# EAGLE design BoxVersion_Taster_v1 (EAGLE 6.2)
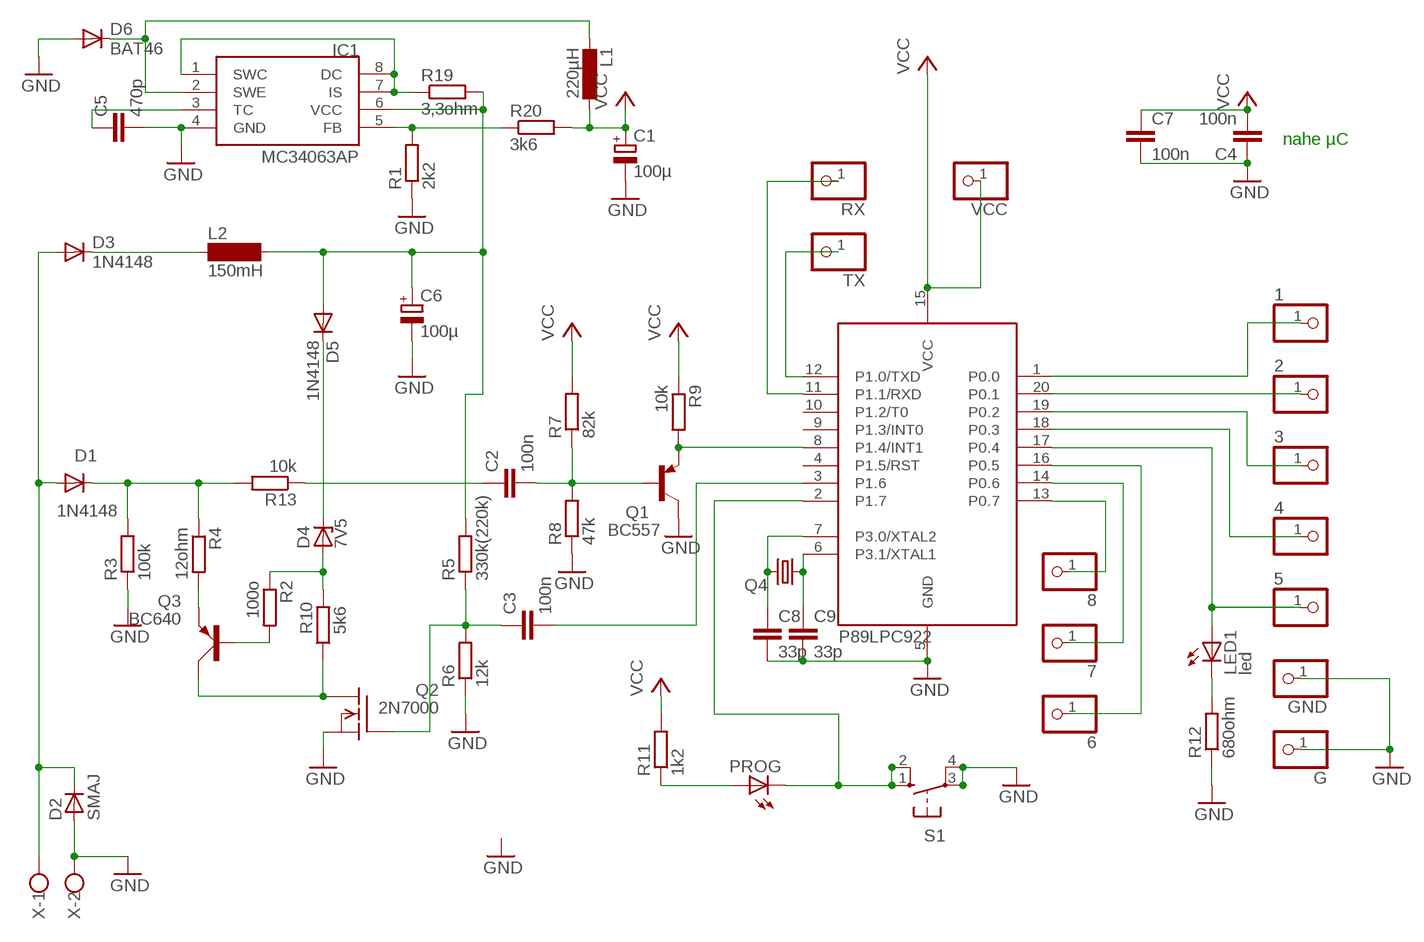
[diagram p0: schematic, sheet 1]

## Parts
1  PINHD-1X1  [1X01]
2  PINHD-1X1  [1X01]
3  PINHD-1X1  [1X01]
4  PINHD-1X1  [1X01]
5  PINHD-1X1  [1X01]
6  PINHD-1X1  [1X01]
7  PINHD-1X1  [1X01]
8  PINHD-1X1  [1X01]
C1  100µ  CPOL-EUE5-5  [E5-5]
C2  100n  C-EU050-024X044  [C050-024X044]
C3  100n  C-EU050-024X044  [C050-024X044]
C4  100n  C-EU050-024X044  [C050-024X044]
C5  470p  C-EU025-024X044  [C025-024X044]
C6  100µ  CPOL-EUE5-6  [E5-6]
C7  100n  C-EUC1206  [C1206]
C8  33p  C-EUC1206  [C1206]
C9  33p  C-EUC1206  [C1206]
D1  1N4148  1N41481N4148S  [D-2.5]
D2  SMAJ  D-MLL-41  [MELF-MLL41]
D3  1N4148  1N41481N4148S  [D-2.5]
D4  7V5  ZENER-DIODEZD-2.5  [ZDIO-2.5]
D5  1N4148  1N41481N4148S  [D-2.5]
D6  BAT46  DIODE-D-2.5  [D-2.5]
G  PINHD-1X1  [1X01]
GND  PINHD-1X1  [1X01]
IC1  MC34063AP  [DIL08]
L1  220µH  L-EU0204/7  [0204/7]
L2  150mH  SD12K100  [SD12K100]
LED1  led  LEDLZR181  [LZR181]
PROG  LEDLZR181  [LZR181]
Q1  BC557  [TO92]
Q2  2N7000  VN2222KM  [TO237]
Q3  BC640  [SOT54D]
Q4  CRYSTALHC49S  [HC49/S]
R1  2k2  R-EU_0207/2V  [0207/2V]
R2  100o  R-EU_0207/2V  [0207/2V]
R3  100k  R-EU_0207/2V  [0207/2V]
R4  12ohm  R-EU_0207/2V  [0207/2V]
R5  330k(220k)  R-EU_0207/2V  [0207/2V]
R6  12k  R-EU_0207/2V  [0207/2V]
R7  82k  R-EU_0207/2V  [0207/2V]
R8  47k  R-EU_0204/7  [0204/7]
R9  10k  R-EU_0207/2V  [0207/2V]
R10  5k6  R-EU_0207/2V  [0207/2V]
R11  1k2  R-EU_0207/2V  [0207/2V]
R12  680ohm  R-EU_0204/7  [0204/7]
R13  10k  R-EU_0207/2V  [0207/2V]
R19  3,3ohm  R-EU_0207/2V  [0207/2V]
R20  3k6  R-EU_0207/2V  [0207/2V]
RX  PINHD-1X1  [1X01]
S1  10-XX  [B3F-10XX]
TX  PINHD-1X1  [1X01]
U1  89LPC922  [DIL20]
VCC  PINHD-1X1  [1X01]
X  W237-02P  [W237-132]

## Nets
GND: C1.- C4.1 C5.2 C6.- C7.2 C8.2 C9.2 D2.2(A) D6.A G.1 GND.1 IC1.4(GND) Q1.3(C) Q2.3(S) R1.1 R3.1 R6.1 R8.1 R12.1 S1.3(P) S1.4(P1) U1.5(GND) X.2
N$1: Q1.1(E) R9.2 U1.8(P1.4/INT1)
N$2: C2.2 Q1.2(B) R7.1 R8.2
N$3: IC1.5(FB) R1.2 R20.1
N$4: IC1.1(SWC) IC1.7(IS) IC1.8(DC) R19.1
N$5: C3.2 U1.3(P1.6)
N$6: Q2.1(D) Q3.C R10.1
N$7: C6.+ D5.A IC1.6(VCC) L2.2 R5.2 R19.2
N$8: D3.C L2.1
N$9: D1.C R3.2 R4.1 R13.2
N$10: D6.C IC1.2(SWE) L1.2
N$11: D4.A R2.1 R10.2
N$12: Q3.E R4.2
N$13: C5.1 IC1.3(TC)
N$14: Q3.B R2.2
N$15: 5.1 LED1.A U1.17(P0.4)
N$16: D1.A D2.1(C) D3.A X.1
N$17: PROG.K(C) S1.1(S) S1.2(S1) U1.2(P1.7)
N$18: LED1.K(C) R12.2
N$19: PROG.A R11.1
N$20: 3.1 U1.19(P0.2)
N$21: 1.1 U1.1(P0.0)
N$22: 2.1 U1.20(P0.1)
N$23: 4.1 U1.18(P0.3)
N$25: TX.1 U1.12(P1.0/TXD)
N$26: RX.1 U1.11(P1.1/RXD)
N$28: 6.1 U1.16(P0.5)
N$29: 8.1 U1.13(P0.7)
N$30: 7.1 U1.14(P0.6)
N$31: C9.1 Q4.1 U1.6(P3.1/XTAL1)
N$32: C8.1 Q4.2 U1.7(P3.0/XTAL2)
N$33: C2.1 R13.1
N$34: C3.1 Q2.2(G) R5.1 R6.2
N$40: D4.C D5.C
VCC: C1.+ C4.2 C7.1 L1.1 R7.2 R9.1 R11.2 R20.2 U1.15(VCC) VCC.1
Unconnected: U1.4(P1.5/RST) U1.9(P1.3/INT0) U1.10(P1.2/T0)

## Notes on the sheet
- nahe µC
- P89LPC922

## Library data of the parts
1-8 G GND RX TX VCC = pinhead:PINHD-1X1: PIN HEADER
C1 C6 = rcl:CPOL-EU: POLARIZED CAPACITOR, European symbol
C2-C5 C7-C9 = rcl:C-EU: CAPACITOR, European symbol
D1 D3 D5 = diode:1N4148: DIODE high speed (Philips)
D2 = semicon-smd-ipc:D-: DIODE unfilled
D4 = diode:ZENER-DIODE: Z-Diode
D6 = diode:DIODE-: DIODE
IC1 = mc34063:MC34063
L1 = rcl:L-EU: INDUCTOR, European symbol
L2 = inductor-neosid:SD12: INDUCTOR nominal inductance
LED1 PROG = led:LED: LED OSRAM: - CHIPLED LG R971, LG N971, LY N971, LG Q971, LY Q971, LO R971, LY R971 LH N974, LH R974 LS Q976, LO Q976, LY Q976 LO Q996 - Hyper CHIPLED LW Q18S LB Q993, LB Q99A, LB R99A - SideLED LS A670, LO A670, LY A670, LG A670, LP A670 LB A673, LV A673, LT A673, LW A673 LH A674 LY A675 LS A676, LA A676, LO A676, LY A676, LW A676 LS A679, LY A679, LG A679 - Hyper Micro SIDELED® LS Y876, LA Y876, LO Y876, LY Y876 LT Y87S - SmartLED LW L88C, LW L88S LB L89C, LB L89S, LG L890 LS L89K, LO L89K, LY L89K LS L896, LA L896, LO L896, LY L896 - TOPLED LS T670, LO T670, LY T670, LG T670, LP T670 LSG T670, LSP T670, LSY T670, LOP T670, LYG T670 LG T671, LOG T671, LSG T671 LB T673, LV T673, LT T673, LW T673 LH T674 LS T676, LA T676, LO T676, LY T676, LB T676, LH T676, LSB T676, LW T676 LB T67C, LV T67C, LT T67C, LS T67K, LO T67K, LY T67K, LW E67C LS E67B, LA E67B, LO E67B, LY E67B, LB E67C, LV E67C, LT E67C LW T67C LS T679, LY T679, LG T679 LS T770, LO T770, LY T770, LG T770, LP T770 LB T773, LV T773, LT T773, LW T773 LH T774 LS E675, LA E675, LY E675, LS T675 LS T776, LA T776, LO T776, LY T776, LB T776 LHGB T686 LT T68C, LB T68C - Hyper Mini TOPLED® LB M676 - Mini TOPLED Santana® LG M470 LS M47K, LO M47K, LY M47K Source: http://www.osram.convergy.de - LUMILED® LXK2-PW12-R00, LXK2-PW12-S00, LXK2-PW14-U00, LXK2-PW14-V00 LXK2-PM12-R00, LXK2-PM12-S00, LXK2-PM14-U00 LXK2-PE12-Q00, LXK2-PE12-R00, LXK2-PE12-S00, LXK2-PE14-T00, LXK2-PE14-U00 LXK2-PB12-K00, LXK2-PB12-L00, LXK2-PB12-M00, LXK2-PB14-N00, LXK2-PB14-P00, LXK2-PB14-Q00 LXK2-PR12-L00, LXK2-PR12-M00, LXK2-PR14-Q00, LXK2-PR14-R00 LXK2-PD12-Q00, LXK2-PD12-R00, LXK2-PD12-S00 LXK2-PH12-R00, LXK2-PH12-S00 LXK2-PL12-P00, LXK2-PL12-Q00, LXK2-PL12-R00 Source: www.luxeon.com
Q1 = transistor-pnp:BC557: PNP Transistor
Q2 = transistor-fet:VN2222KM: N-Channel Enhancement MOSFET (VMOS); 60V; 0,5A; 7,5Ohm
Q3 = transistor-small-signal:BC640: PNP TRANSISTOR
Q4 = crystal:CRYSTAL: CRYSTAL
R1-R13 R19 R20 = rcl:R-EU_: RESISTOR, European symbol
S1 = switch-omron:10-XX: OMRON SWITCH; MPN: B3F-1000; OC_FARNELL: 176432; OC_NEWARK: 36M3542
U1 = micro-philips:89LPC922
X = con-wago-508:W237-02P: WAGO SREW CLAMP

## Board
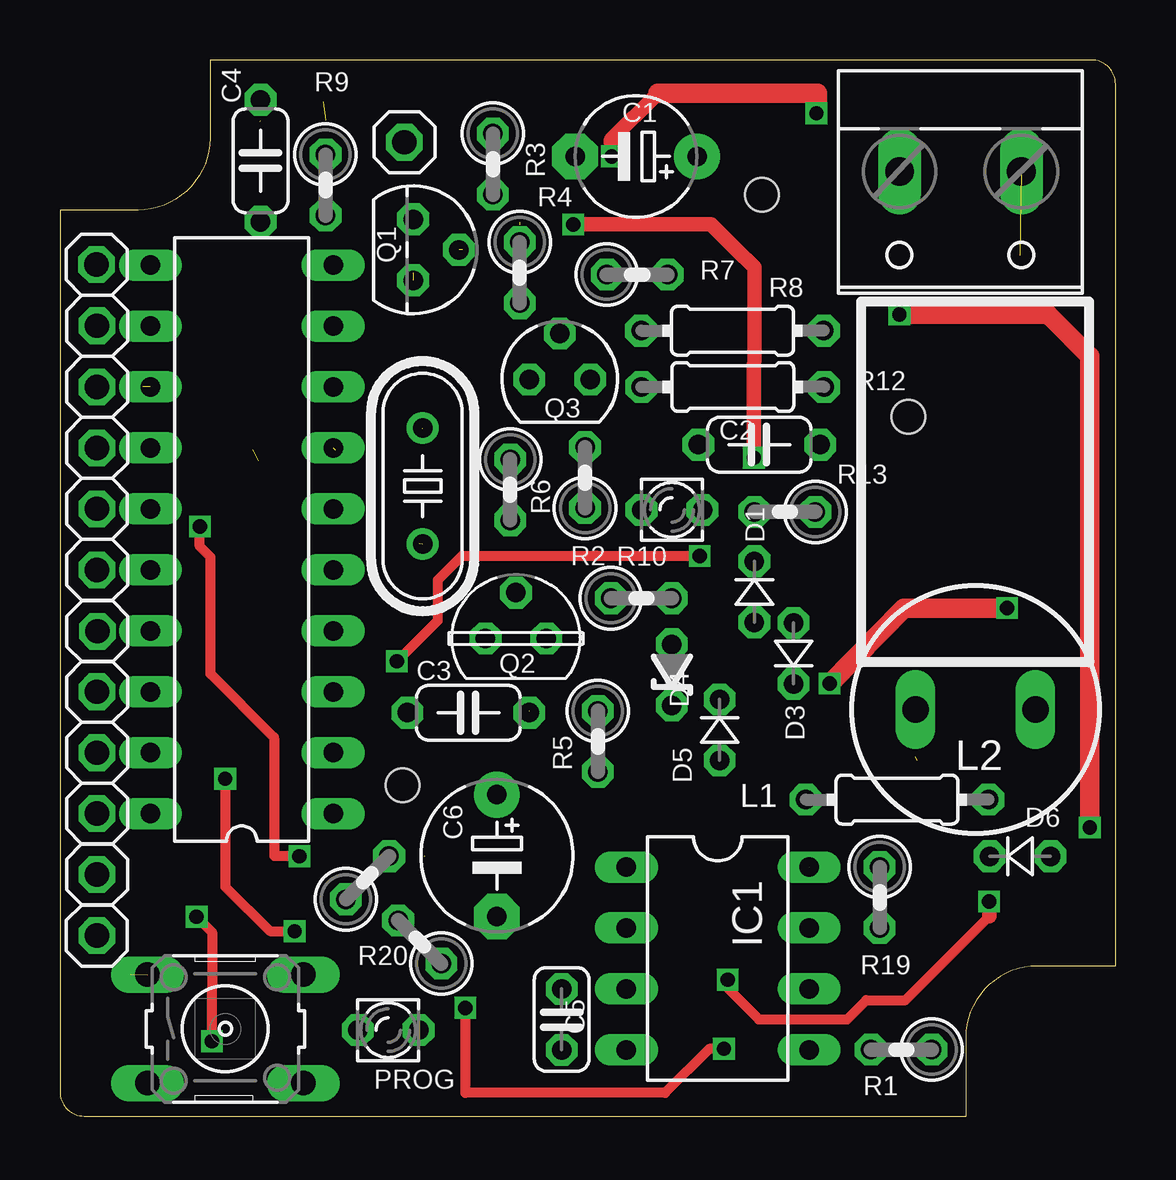
[diagram p1: board, top side]
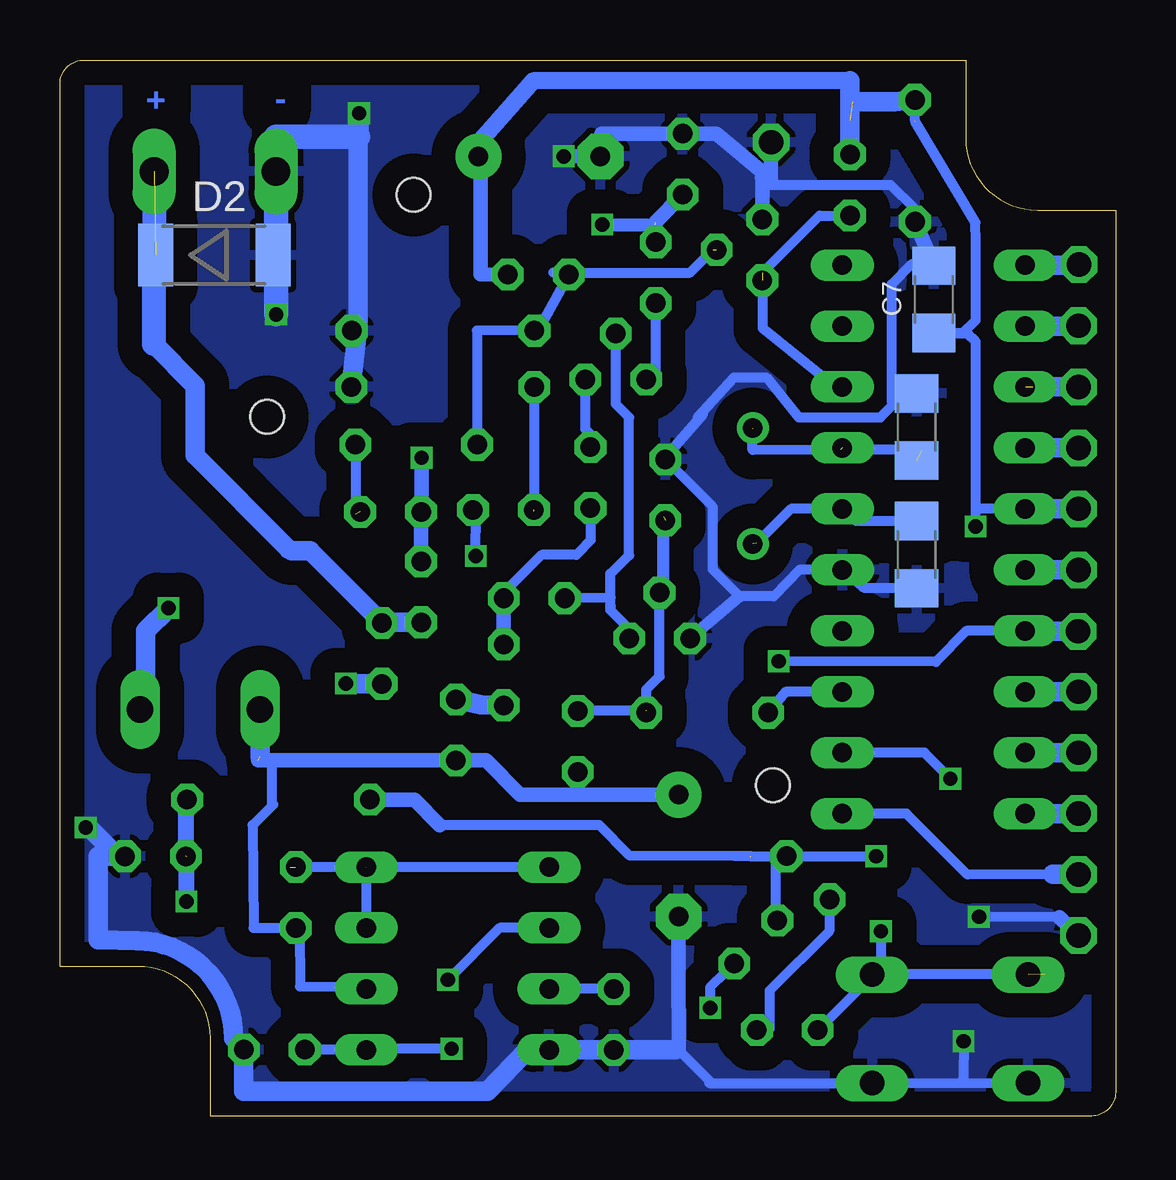
[diagram p2: board, bottom side, seen from below]

Size 44 x 44 mm. Coordinates in mm from the lower left corner, seen from the top.
Copper layers (1*16): Top 0.035mm / dielectric 1.5mm / Bottom 0.035mm
Design rules: minimum track width 6mil, minimum drill 12mil, track to track 6mil, track to pad 6mil, pad to pad 6mil, via to via 6mil, smd to smd 0mil, copper to edge 10mil, drill to drill 10mil, minimum pad ring 10mil, minimum via ring 6mil, stop-mask expansion 2mil, vias tented up to drill 100mil, thermal gap 10mil
Holes 1.4 mm at 29.26,38.38 35.36,29.13 14.27,13.78

### Footprints (pad centres in the part's own frame; a part is rotated, then mirrored left to right if it is on the bottom)
1X01 = drill 1.016 octagon: 1 0,0
E5-5 = drill 0.813 pad 1.905: + -2.54,0 | drill 0.813 pad 1.905 octagon: - 2.54,0
C050-024X044 = drill 0.813 octagon: 1 -2.54,0; 2 2.54,0
C025-024X044 = drill 0.813 octagon: 1 -1.27,0; 2 1.27,0
E5-6 = drill 0.813 pad 1.905: + -2.54,0 | drill 0.813 pad 1.905 octagon: - 2.54,0
C1206 = smd 1.6 x 1.8: 1 -1.4,0; 2 1.4,0
D-2.5 = drill 0.813 octagon: A 1.27,0; C -1.27,0
MELF-MLL41 = smd 1.45 x 2.6: 1 -2.445,0; 2 2.445,0
ZDIO-2.5 = drill 0.813 octagon: A 1.27,0; C -1.27,0
DIL08 = drill 0.813 long: 1 -3.81,-3.81; 2 -1.27,-3.81; 3 1.27,-3.81; 4 3.81,-3.81; 5 3.81,3.81; 6 1.27,3.81; 7 -1.27,3.81; 8 -3.81,3.81
0204/7 = drill 0.813 octagon: 1 -3.81,0; 2 3.81,0
SD12K100 = drill 1.1 long: 1 -2.5,0; 2 2.5,0
LZR181 = drill 0.813 octagon: A -1.27,0; K 1.27,0
TO92 = drill 0.813 octagon: 1 1.27,0; 2 0,1.905; 3 -1.27,0
TO237 = drill 0.813 octagon: 1 1.27,0; 2 0,1.905; 3 -1.27,0
SOT54D = drill 0.813 octagon: B 1.27,0; C 0,1.905; E -1.27,0
HC49/S = drill 0.813: 1 -2.413,0; 2 2.413,0
0207/2V = drill 0.813 octagon: 1 -1.27,0; 2 1.27,0
B3F-10XX = drill 1.016 long: 1 -3.251,2.261; 2 3.251,2.261; 3 -3.251,-2.261; 4 3.251,-2.261
DIL20 = drill 0.813 long: 1 -11.43,-3.81; 2 -8.89,-3.81; 3 -6.35,-3.81; 4 -3.81,-3.81; 5 -1.27,-3.81; 6 1.27,-3.81; 7 3.81,-3.81; 8 6.35,-3.81; 9 8.89,-3.81; 10 11.43,-3.81; 11 11.43,3.81; 12 8.89,3.81; 13 6.35,3.81; 14 3.81,3.81; 15 1.27,3.81; 16 -1.27,3.81; 17 -3.81,3.81; 18 -6.35,3.81; 19 -8.89,3.81; 20 -11.43,3.81
W237-132 = drill 1.194 long: 1 -2.54,-0.635; 2 2.54,-0.635

### Placement (x,y rotation side)
1  1.54,10.06 0 top
2  1.54,12.6 0 top
3  1.54,15.14 0 top
4  1.54,17.68 0 top
5  1.56,20.2 0 top
6  1.54,22.76 0 top
7  1.54,27.84 0 top
8  1.54,30.38 0 top
C1  24.01,39.98 180 top
C2  29.15,27.97 180 top
C3  17.02,16.8 180 top
C4  8.36,39.8 90 top
C5  20.91,4.02 270 top
C6  18.21,10.85 270 top
C7  7.58,34.03 90 bottom
C8  8.29,28.71 90 bottom
C9  8.29,23.39 270 bottom
D1  28.95,21.84 270 top
D2  37.56,35.87 0 bottom
D3  30.58,19.28 90 top
D4  25.51,18.38 90 top
D5  27.49,16.09 270 top
D6  40.02,10.82 0 top
G  1.54,7.52 0 top
GND  14.36,40.57 0 top
IC1  27.42,6.56 270 top
L1  34.89,13.18 0 top
L2  38.17,16.94 180 top
LED1  25.51,25.26 180 top
PROG  13.68,3.58 180 top
Q1  14.72,36.09 270 top
Q2  19.01,19.9 0 top
Q3  20.83,30.69 0 top
Q4  15.12,26.25 90 top
R1  35.07,2.77 180 top
R2  21.89,26.6 90 top
R3  18.05,39.66 270 top
R4  19.17,35.14 270 top
R5  22.42,15.61 270 top
R6  18.77,26.09 270 top
R7  24.06,35.06 0 top
R8  28.03,32.72 180 top
R9  11.07,38.79 270 top
R10  24.24,21.57 0 top
R11  12.82,9.93 45 top
R12  28.04,30.38 180 top
R13  30.22,25.17 180 top
R19  34.17,9.1 270 top
R20  15,7.25 135 top
RX  1.53,35.48 0 top
S1  6.89,3.63 0 top
TX  1.55,32.93 0 top
U1  7.58,24.03 90 top
U$1  [1551R]  44,0 90 top
VCC  1.54,25.3 0 top
X  37.53,38.72 180 top

### Tracks (layer width: path | path; a pad name or v marks a point on that pad's centre or on a via)
GND  (via drill 0.6)
  Top 0.406: v5.69,8.3 6.34,7.66 v6.33,3.11
  Top 0.61: v23,39.99 22.97,40.69 24.93,42.61
  Top 0.813: v34.99,33.4 41.17,33.4 42.92,31.65 v42.93,12.02 | 24.93,42.61 31.57,42.61 31.57,42.42 v31.53,41.78
  Bottom 0.406: Q1.3 14.72,38.79 9.37,38.79 8.37,37.8 | R1.1 36.4,2.86 | C4.1 8.35,37.77 | C9.2 10.46,21.99 11.31,22.76 U1.5 13.18,22.76 14.24,21.65 15.67,21.65 16.78,22.77 16.78,25.38 R6.1 | 7.87,36.11 7.42,35.46 C7.2 8.48,35.51 9.32,34.66 9.32,29.76 8.61,30.22 8.69,30.22 9.8,29.11 13.21,29.11 14.56,30.77 15.91,30.77 17.42,29.11 17.18,29.26 18.77,27.44 R6.1 | R6.1 | 36.34,1.02 34.17,1.09 34.17,1.17 | 10.27,1.36 6.29,1.38 | 6.29,1.38 S1.3 | 35.06,35.85 X.2 34.99,40.79 | S1.4 16.93,1.37 16.93,1.47 18.2,2.74 | 21.42,40.93 C1.- | 18.34,2.75 18.23,2.77 | 41.21,10.91 D6.A | 31.58,37.15 31.49,37.24 31.49,37.25 | 31.53,40.79 31.58,40.79 | 2.33,8.28 v5.69,8.3 | v6.33,3.11 6.35,1.55 6.29,1.38 | v42.93,12.02 42.79,12.02
  Bottom 0.5: Q2.3 15.67,21.65
  Bottom 0.6: 14.74,39.1 14.36,39.03 | 7.87,36.11 C4.1 | 16.63,40.93 21.42,40.93
  Bottom 0.61: 18.2,2.74 18.21,6.25 C6.- | Q1.3 14.72,39.11 | 16.63,40.93 14.36,39.03 14.36,40.38 GND.1 | C1.- v23,39.99 | G.1 2.33,8.28
  Bottom 0.813: R1.1 36.34,1.02 26.18,1.02 24.51,2.75 IC1.4 C5.2 18.34,2.75 | 36.4,2.86 36.76,3.23 arc-90 40.78,7.31 42.4,7.33 42.4,10.83 41.58,10.81 | R12.1 31.58,33 31.58,37.15 31.58,39.23 31.58,40.79 | 41.58,10.81 D6.A | v31.53,41.78 31.53,40.79 | 42.79,12.02 41.58,10.81
  Bottom 1.016: X.2 v34.99,33.4 | 31.58,40.79 34.99,40.79
  pour Bottom (isolate 1.016): -0.48,38.08 6.09,44.61 35.04,44.56 44.47,44.59 44.46,5.33 38.4,-0.49 13.91,-0.49 -0.54,-0.54
N$1  (1 unrouted)
  Bottom 0.406: U1.8 11.7,30.38 14.71,32.83 14.71,35.14 14.72,35.14 12.34,37.52 R9.2
N$2  (1 unrouted)
  Bottom 0.406: 16.78,36.09 17.74,35.14 23.44,35.14 R7.1 24.02,32.83 R8.2 26.62,32.74 C2.2
N$3  (via drill 0.6)
  Top 0.406: v27.68,2.8 27.07,2.8 25.22,0.97 16.9,0.97 v16.9,4.51
  Bottom 0.406: 31.24,2.66 IC1.5 | IC1.5 33.45,2.75 R1.2 | R20.1 16.27,5.98 16.9,5.36 v16.9,4.51 | v27.68,2.8 31.23,2.8 IC1.5
N$4  (2 unrouted)
  Bottom 0.406: IC1.8 | IC1.8 34.41,10.37 | IC1.8 IC1.7 | IC1.1 IC1.8
N$5
  Bottom 0.406: C3.2 13.77,17.68 U1.3
N$6
  Bottom 0.406: Q3.C 20.83,29.66 20.28,29.11 20.28,23.36 21.06,22.6 21.06,21.18 21.03,21.05 | 21.03,21.05 21.05,21.6 R10.1 23.01,21.77 | 21.03,21.05 21.07,21.09 | 21.03,21.05 | Q2.1 20.28,20.3 21.03,21.05
N$7  (1 unrouted)
  Bottom 0.406: 31.18,5.41 34,5.39 34.01,7.83 34.01,8.07 R19.2 35.94,7.83 35.97,12.12 35.11,12.97 35.16,12.97 35.16,14.82 | 31.18,5.41 30.96,5.25 | 22.42,13.39 R5.2 | IC1.6 31.45,5.23 31.18,5.41 | D5.A 26.95,14.82 | 26.95,14.82
  Bottom 0.61: C6.+ 22.42,13.39 24.82,13.39 26.24,14.82 26.95,14.82 35.16,14.82 35.73,14.82
  Bottom 0.813: 35.67,14.96 L2.2
N$8  (via drill 0.6)
  Top 0.813: v32.09,18.02 35.19,21.16 v39.48,21.16
  Bottom 0.813: D3.C v32.09,18.02 | v39.48,21.16 40.42,20.22 40.42,17.52 L2.1
N$9  (via drill 0.6)  (1 unrouted)
  Top 0.61: v28.93,27.43 28.94,35.37 28.18,36.11 27.14,37.17 v21.39,37.15
  Bottom 0.406: v21.39,37.15 21.41,37.14 | R13.2 28.93,25.14 | D1.C
  Bottom 0.55: 19.19,37.14 21.41,37.14 21.17,37.16
  Bottom 0.61: 28.93,25.14 v28.93,27.43 | R3.2 19.19,37.24 R4.1 | R13.2 D1.C
N$10  (via drill 0.6)  (1 unrouted)
  Top 0.406: v27.83,5.68 27.86,5.3 29.13,4.03 32.82,4.02 33.61,4.83 35.24,4.83 38.73,8.32
  Top 0.61: 38.73,8.32 v38.73,8.94
  Bottom 0.406: IC1.2 25.67,7.83 v27.83,5.68 | L1.2 38.76,13.3
  Bottom 0.66: v38.73,8.94 38.73,10.81 | 38.76,13.3 D6.C
N$11
  Bottom 0.406: R2.1 21.88,23.99 22.41,23.45 22.48,23.38 23.92,23.38 25.51,21.8 R10.2
  Bottom 0.61: D4.A 25.51,19.95 R10.2
N$12
  Bottom 0.406: R4.2 19.17,31.09 Q3.E
N$13
  Bottom 0.406: C5.1 IC1.3
N$14
  Bottom 0.406: R2.2 21.88,28.2 21.88,28.39 22.1,28.63 Q3.B
N$15  (via drill 0.6)
  Top 0.406: v14.04,18.95 15.75,20.65 15.75,22.34 16.77,23.35 22.37,23.35 v26.67,23.34
  Bottom 0.406: v26.67,23.34 26.66,25.22 26.86,25.43 LED1.A | v14.04,18.95 7.49,18.92 6.22,20.21 U1.17 3.77,20.2
  Bottom 0.813: 5.1 3.77,20.2
N$16  (1 unrouted)
  Bottom 0.406: 34.35,23.55 34.46,23.61 | 30.57,20.57 D3.A
  Bottom 0.813: 40.09,32.17 38.37,30.43 38.37,28.48 38.37,27.52 34.46,23.61 | D1.A 30.57,20.57 | 34.35,23.55 33.58,23.55 D3.A
  Bottom 1: X.1 40.09,32.17
N$17  (via drill 0.6)  (1 unrouted)
  Top 0.406: v6.88,14.05 6.89,9.55 8.77,7.71 v9.78,7.7
  Bottom 0.406: 2.95,5.91 9.77,5.91 | 9.77,5.91 10.13,5.91 | 10.13,5.91 S1.2 | v9.78,7.7 9.78,6.55 9.77,5.91 | 10.13,5.91 10.17,5.8 PROG.K | v6.88,14.05 7.97,15.14 U1.2
N$18  (1 unrouted)
  Bottom 0.406: R12.2 24.25,25.2
N$19
  Bottom 0.406: R11.1 11.93,7.7 14.42,5.22 14.42,3.62 PROG.A
N$20
  Bottom 0.813: 3.1 U1.19
N$21
  Bottom 0.406: 2.61,10.06 6.17,10.05 8.71,12.6 U1.1
  Bottom 0.813: 1.1 2.61,10.06
N$22
  Bottom 0.406: U1.20
  Bottom 0.813: 2.1 U1.20
N$23
  Bottom 0.406: U1.18 3.61,17.68 3.88,17.68
  Bottom 0.813: 4.1 3.88,17.68
N$25
  Bottom 0.406: TX.1
  Bottom 0.813: U1.12 TX.1
N$26
  Bottom 0.406: 1.53,35.46 RX.1
  Bottom 0.813: U1.11 1.53,35.46
N$28
  Bottom 0.813: 6.1 U1.16
N$29  (1 unrouted)
  Bottom 0.406: 2.18,30.46 3.45,30.38 | 8.1
  Bottom 0.813: 8.1 U1.13
N$30
  Bottom 0.406: U1.14 3.93,27.84
  Bottom 0.813: 7.1 U1.14
N$31  (1 unrouted)
  Bottom 0.406: C9.1 10.8,24.79 11.31,25.3 U1.6 13.53,25.3 14.96,23.87
N$32  (3 unrouted)
  Bottom 0.406: 8.05,27.76 11.47,27.76 15.13,27.74 15.1,28.63
N$33  (1 unrouted)
  Bottom 0.406: C2.1 31.67,27.26 31.67,25.07 | 31.43,25.45 R13.1
N$34  (2 unrouted)
  Bottom 0.406: R5.1 19.55,16.88 19.56,17.36 C3.1 | 19.56,16.88 | 19.56,16.88 19.56,17.76 19.01,18.32 Q2.2 19.01,22.11 18.85,21.8
  Bottom 0.5: 18.85,21.8 18.85,24.98
N$40
  Bottom 0.813: D5.C 26.46,17.13 D4.C
VCC  (via drill 0.6)  (3 unrouted)
  Top 0.406: v9.98,10.82 8.94,10.82 8.94,15.68 8.91,15.79 6.27,18.42 6.27,23.29 5.83,23.73 v5.83,24.56
  Bottom 0.406: 28.18,12.12 21.51,12.12 20.25,10.85 15.87,10.83 15.2,10.82 14.15,10.82 | R9.1 11.07,39.9 | 26.47,40.66 C1.+ | 5.83,25.3 5.83,32.28 6.15,32.6 7.34,32.6 7.37,32.63 C7.1 6.36,32.63 5.83,33.15 5.83,36.41 5.84,37.23 8.34,41.43 | 8.36,41.46 C4.2 | 15.22,10.81 14.05,10.82 14.07,10.82 R11.2 | VCC.1 | 14.15,10.82 v9.98,10.82 | U1.15 5.83,25.3 | v5.83,24.56 5.83,24.4 5.83,25.3 | R20.2 14.15,8.29 14.15,10.82
  Bottom 0.6: 28.18,12.12 29.22,13.18 L1.1
  Bottom 0.61: R7.2 26.47,35.07 26.48,39.21 C1.+
  Bottom 0.7: 11.07,43.13 24.29,43.13 26.47,40.66
  Bottom 0.813: C4.2 9.22,42.26 10.97,42.26 | R9.1 11.07,41.49 11.07,43.13 | U1.15 VCC.1

### Text on the board
Bottom: - | +
tValues: Box v1